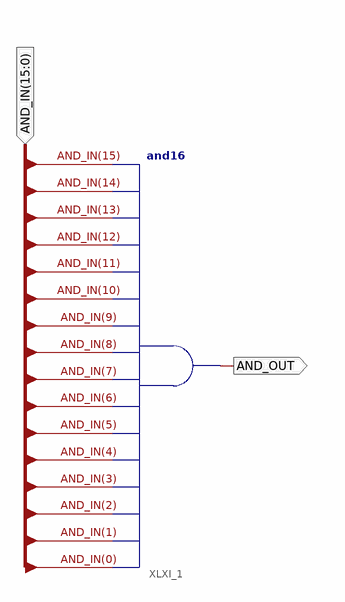
[diagram p0: schematic sheet 1]
// Xilinx ISE schematic and_16bit.sch (spartan6) as structural Verilog: 1 symbols, 2 ports
module and_16bit (
  input  [15:0] AND_IN,
  output AND_OUT
);

  and XLXI_1 (AND_OUT, AND_IN[0], AND_IN[1], AND_IN[2], AND_IN[3], AND_IN[4], AND_IN[5], AND_IN[6], AND_IN[7], AND_IN[8], AND_IN[9], AND_IN[10], AND_IN[11], AND_IN[12], AND_IN[13], AND_IN[14], AND_IN[15]);
endmodule
